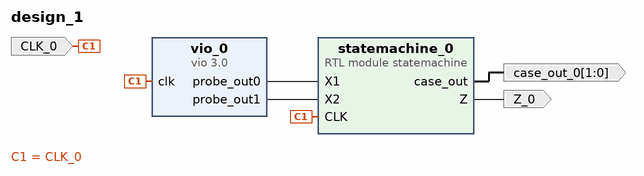
[diagram p0: block diagram of the top level]
# Vivado block design design_1, xc7z020clg400-1, Vivado 2022.1
create_bd_design design_1

create_bd_port -dir I -type clk CLK_0
create_bd_port -dir O -from 1 -to 0 case_out_0
create_bd_port -dir O Z_0

create_bd_cell -type module -reference statemachine statemachine_0
create_bd_cell -type ip -vlnv xilinx.com:ip:vio:3.0 vio_0
set_property -dict {CONFIG.C_NUM_PROBE_IN 0 CONFIG.C_NUM_PROBE_OUT 2} [get_bd_cells vio_0]

# ---- connections ----

connect_bd_net -net CLK_0_1 [get_bd_ports CLK_0] [get_bd_pins statemachine_0/CLK] [get_bd_pins vio_0/clk]
connect_bd_net [get_bd_pins statemachine_0/Z] [get_bd_ports Z_0]
connect_bd_net [get_bd_pins statemachine_0/case_out] [get_bd_ports case_out_0]
connect_bd_net [get_bd_pins vio_0/probe_out0] [get_bd_pins statemachine_0/X1]
connect_bd_net [get_bd_pins vio_0/probe_out1] [get_bd_pins statemachine_0/X2]

validate_bd_design
save_bd_design
